# Altium schematic sheet usb.schdoc: {Наименование}
size 209 x 297 mm; DocumentNumber: {Обозначение}; SheetNumber: {}; SheetTotal: {}; PageSetup: Record=PageOptions|CenterHorizontal=False|CenterVertical=False|PrintScale=0.95|XCorrection=0.00|YCorrection=0.00|PrintKind=1|BorderSize=5000000|LeftOffset=0|BottomOffset=0|Orientation=1|PaperLength=1000|PaperWidth=1000|Scale=100|PaperSource=15|PrintQuality=600|MediaType=1|DitherType=10|PaperKind=A4|PrintScaleMode=1; Rule: PcbType=ProtelPcb
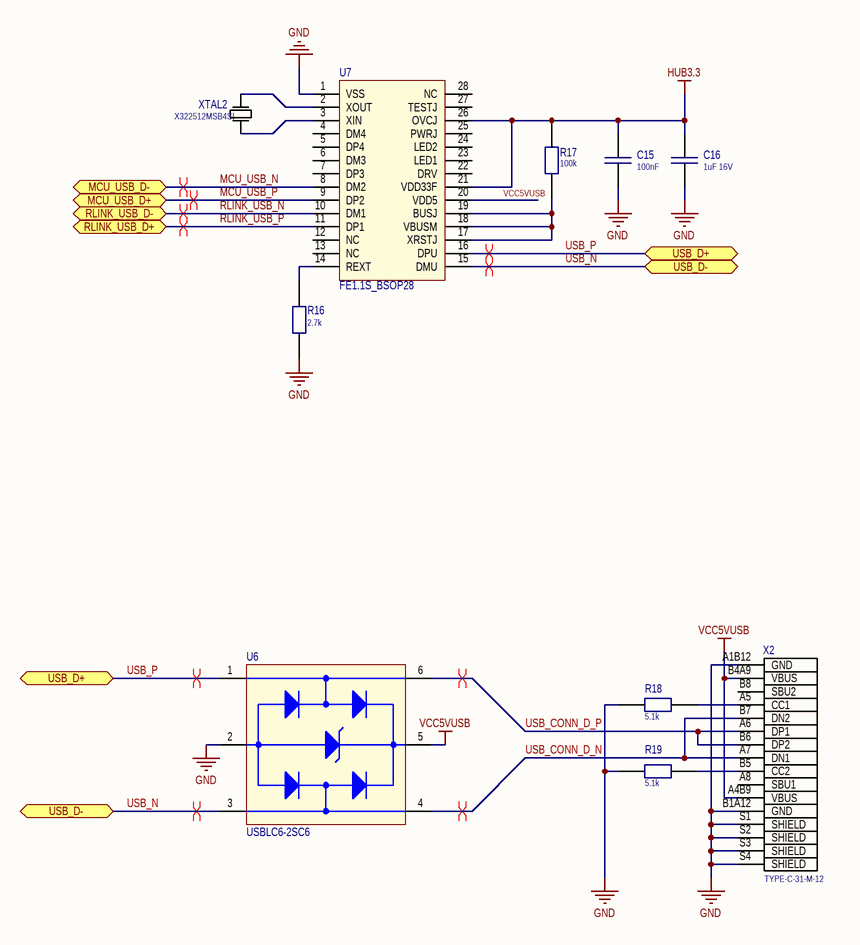
[diagram p0: usb.schdoc]

## Parts
C15  100nF  [C_0603]
C16  1uF 16V  [C_0603]
R16  2.7k  [R_0603]
R17  100k  [R_0603]
R18  5.1k  [R_0603]
R19  5.1k  [R_0603]
U6  USBLC6-2SC6  [SOT95P280X145-6N]
U7  FE1.1S_BSOP28  [BSOP28]
X2  TYPE-C-31-M-12  [HRO_TYPE-C-31-M-12]
XTAL2  X322512MSB4SI  [NX3225GA]

## Ports
MCU_USB_D+ (bidir), MCU_USB_D- (bidir), RLINK_USB_D+ (bidir), RLINK_USB_D- (bidir), USB_D+ (bidir), USB_D- (bidir)

## Nets
GND: C15.1 C16.1 R16.1 R18.1 R19.1 U6.2(GND) U7.1(VSS) X2.A1B12(GND) X2.B1A12(GND) X2.S1(SHIELD) X2.S2(SHIELD) X2.S3(SHIELD) X2.S4(SHIELD)
HUB3.3: C15.2 C16.2 R17.2 U7.21(VDD33F) U7.26(OVCJ)
VCC5VUSB: U6.5(VBUS) U7.20(VDD5) X2.A4B9(VBUS) X2.B4A9(VBUS)
MCU_USB_N: U7.8(DM2) ; port MCU_USB_D-
MCU_USB_P: U7.9(DP2) ; port MCU_USB_D+
RLINK_USB_N: U7.10(DM1) ; port RLINK_USB_D-
RLINK_USB_P: U7.11(DP1) ; port RLINK_USB_D+
USB_CONN_D_N: U6.4(I/O2_OUT) X2.A7(DN1) X2.B7(DN2)
USB_CONN_D_P: U6.6(I/O1_OUT) X2.A6(DP1) X2.B6(DP2)
USB_N: U6.3(I/O2_IN) U7.15(DMU) ; port USB_D-
USB_P: U6.1(I/O1_IN) U7.16(DPU) ; port USB_D+
NetR16_2: R16.2 U7.14(REXT)
NetR17_1: R17.1 U7.17(XRSTJ) U7.18(VBUSM) U7.19(BUSJ)
NetR18_2: R18.2 X2.A5(CC1)
NetR19_2: R19.2 X2.B5(CC2)
NetU7_2: U7.2(XOUT) XTAL2.1(OSC1)
NetU7_3: U7.3(XIN) XTAL2.3(OSC2)

Not connected (* = marked no-connect by the designer): U7 4(DM4) 5(DP4) 6(DM3) 7(DP3) 12(NC) 13(NC) 22(DRV) 23(LED1) 24(LED2) 25(PWRJ) 27(TESTJ) 28(NC); X2 A8(SBU1) B8(SBU2)

## Layout directives
differential pair: MCU_USB_N, MCU_USB_P, RLINK_USB_N, RLINK_USB_P, USB_CONN_D_N, USB_CONN_D_P, USB_N, USB_P

## Library data of the parts
C15 = C0603: Capacitor; Part Number: CC0603JPX7R9BB104; Value: 100nF
C16 = C0603: Capacitor; Part Number: CC0603KRX7R7BB105; Value: 1uF 16V
R16 = RES_SMD: Resistor; Part Number: RC0603FR-072K7L; Alternative Part: *; Value: 2.7k
R17 = RES_SMD: Resistor; Part Number: RC0603FR-07100KL; Alternative Part: *; Value: 100k
R18 R19 = RES_SMD: Resistor; Part Number: RC0603JR-075K1L; Alternative Part: *; Value: 5.1k
U6 = USBLC6-2SC6: 17V Clamp 5A (8/20Âµs) Ipp Tvs Diode Surface Mount SOT-23-6; MF: STMicroelectronics; Value: *; Check_prices: https://www.snapeda.com/parts/USBLC6-2SC6/STMicroelectronics/view-part/?ref=eda; MP: USBLC6-2SC6; Purchase-URL: https://pricing.snapeda.com/search/part/USBLC6-2SC6/?ref=eda; Price: None; Availability: In Stock; Package: SOT-23-6 STMicroelectronics; SnapEDA_Link: https://www.snapeda.com/parts/USBLC6-2SC6/STMicroelectronics/view-part/?ref=snap; Part Number: USBLC6-2SC6; Alternative Part: *
U7 = FE1.1S_BSOP28: USB HUB 2.0; Part Number: FE1.1S-BSOP28BCN
X2 = TYPE-C-31-M-12: USB Connectors 24 Receptacle 1 8.94*7.3mm RoHS; Package: None; Availability: Unavailable; Value: *; MP: TYPE-C-31-M-12; Price: None; Part Number: TYPE-C-31-M-12; Alternative Part: *
XTAL2 = NX3225GA: Crystal Oscillator; Part Number: X322512MSB4SI; Alternative Part: *